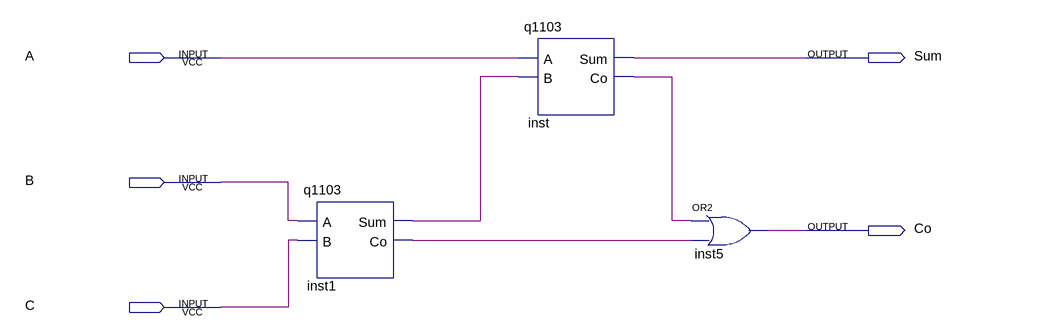
[diagram p0: schematic sheet]
// Quartus schematic FA.bdf as structural Verilog: 3 symbols, 5 pins
module FA (
  input  A,
  input  B,
  input  C,
  output Sum,
  output Co
);

  wire inst1_co, inst1_sum, inst_co;

  q1103 inst1 (.A(B), .B(C), .Sum(inst1_sum), .Co(inst1_co));
  q1103 inst (.A(A), .B(inst1_sum), .Sum(Sum), .Co(inst_co));
  or inst5 (Co, inst_co, inst1_co);
endmodule
